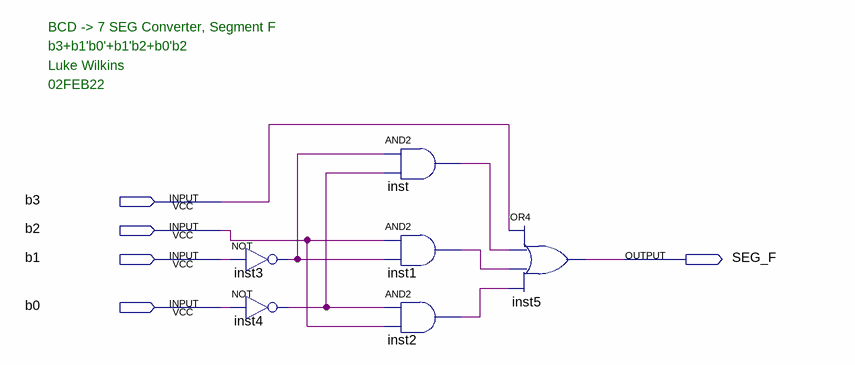
[diagram p0: schematic sheet]
// Quartus schematic BCD_7SEG_F.bdf as structural Verilog: 6 symbols, 5 pins
module BCD_7SEG_F (
  input  b3,
  input  b2,
  input  b1,
  input  b0,
  output SEG_F
);

  wire inst1_out, inst2_out, inst3_out, inst4_out, inst_out;

  not inst3 (inst3_out, b1);
  not inst4 (inst4_out, b0);
  and inst (inst_out, inst3_out, inst4_out);
  and inst1 (inst1_out, b2, inst3_out);
  and inst2 (inst2_out, inst4_out, b2);
  or inst5 (SEG_F, b3, inst_out, inst1_out, inst2_out);

  // Notes on the sheet:
  //   BCD -> 7 SEG Converter, Segment F
  //   b3+b1'b0'+b1'b2+b0'b2
  //   Luke Wilkins
  //   02FEB22
endmodule
